# Altium project LIB_TEST.PrjPcb (part 1 of 4)
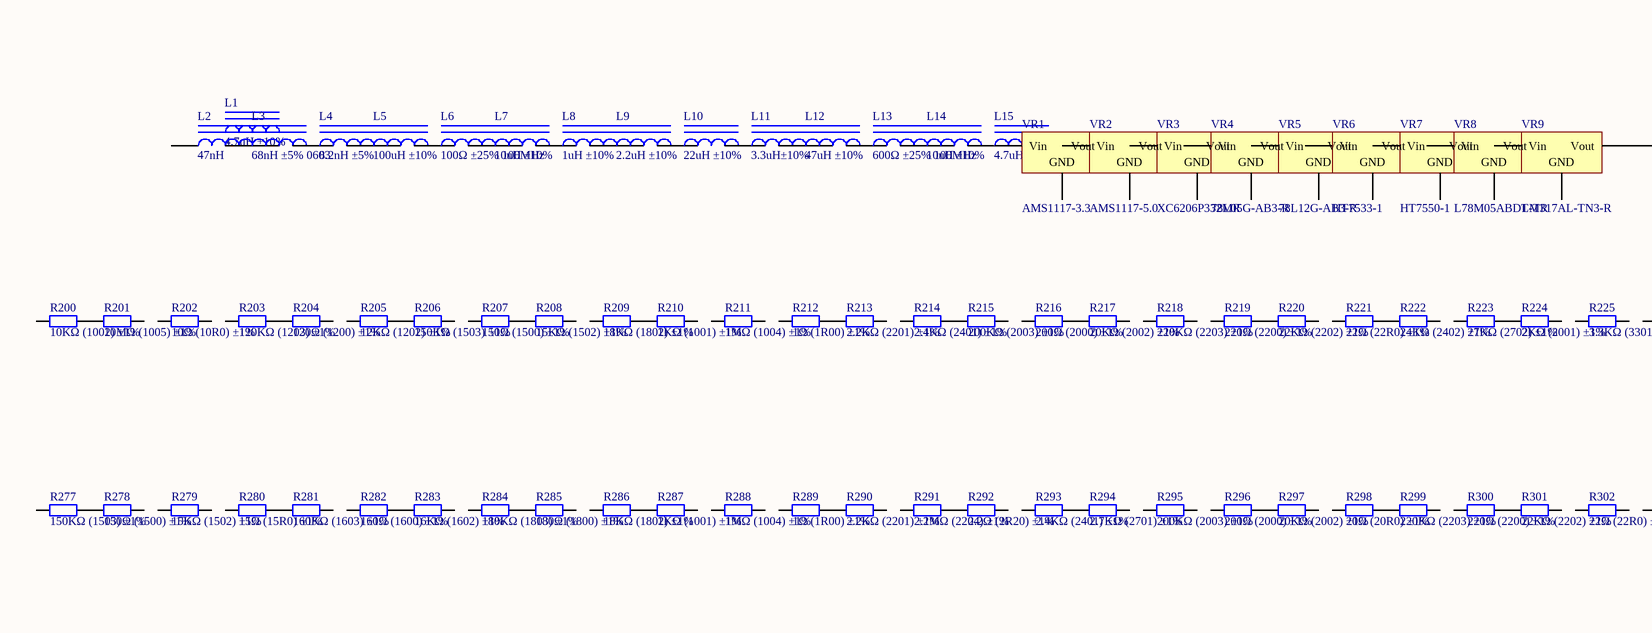
[diagram p0: 2.SchDoc, left]
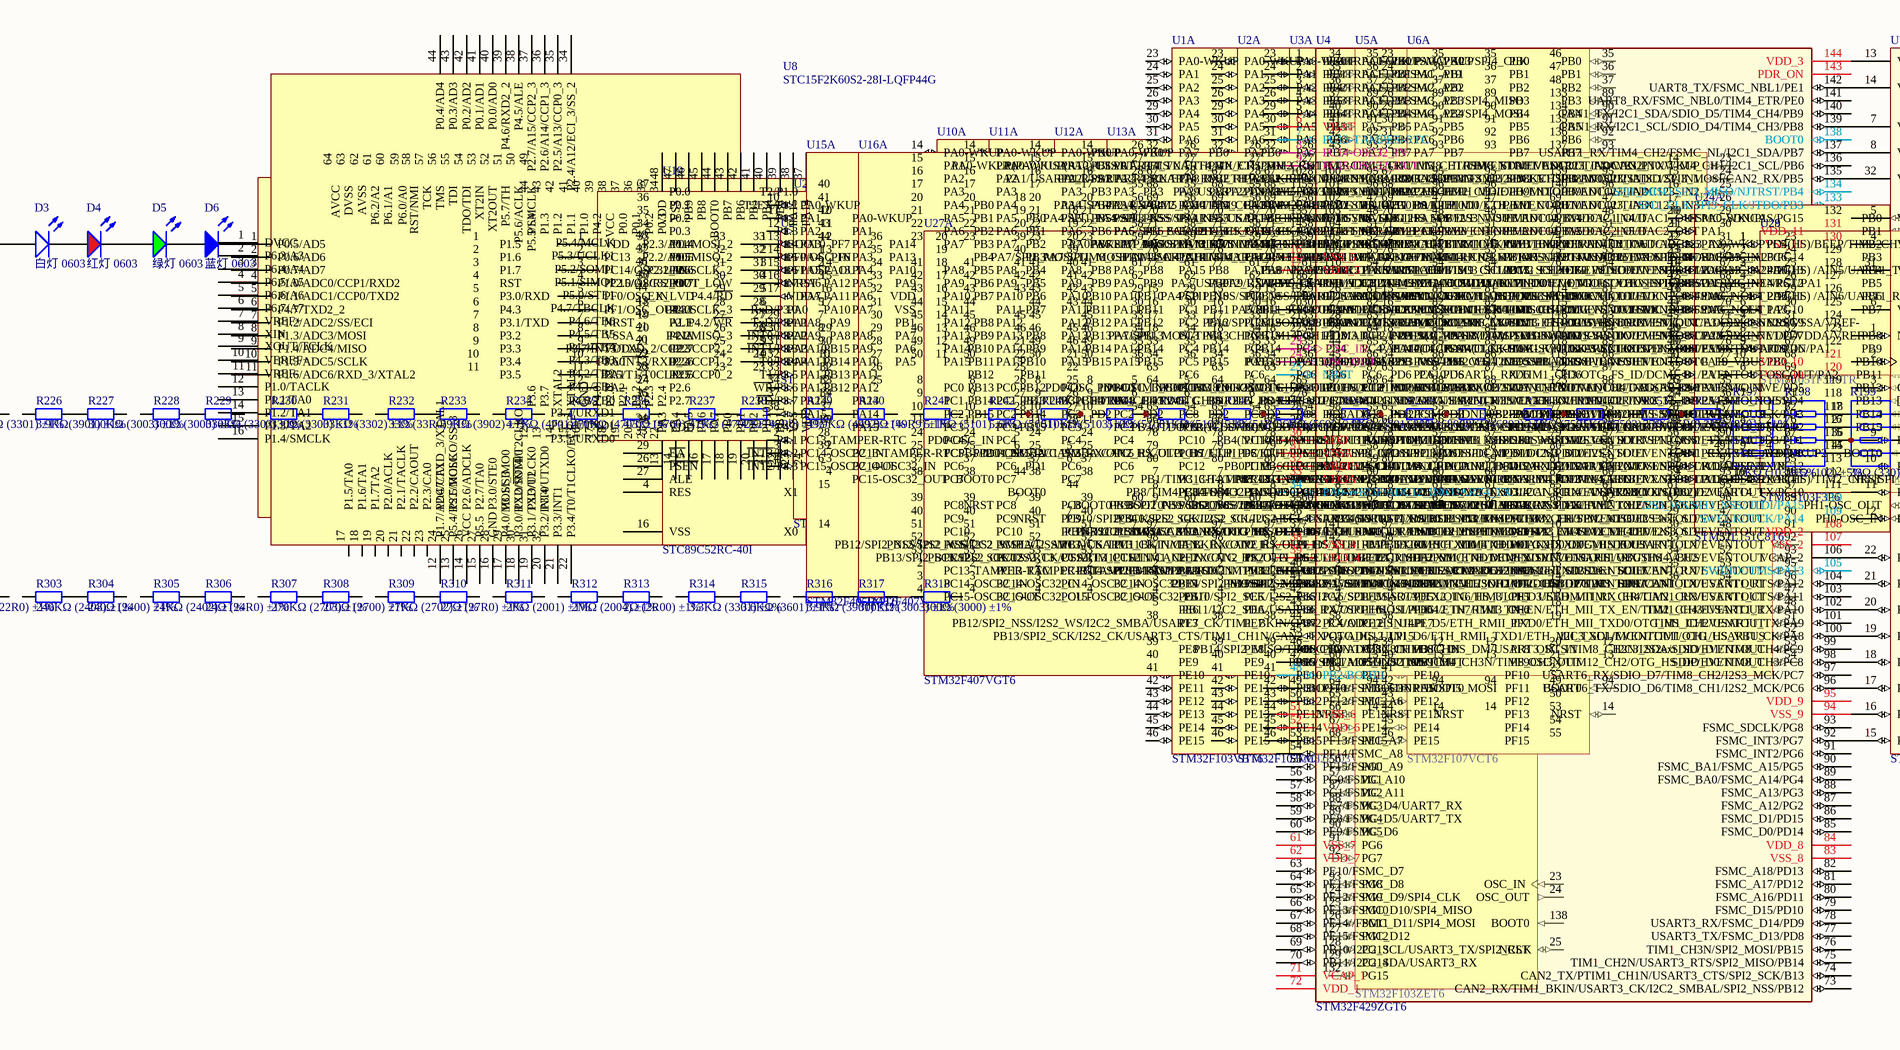
[diagram p1: 2.SchDoc, middle]
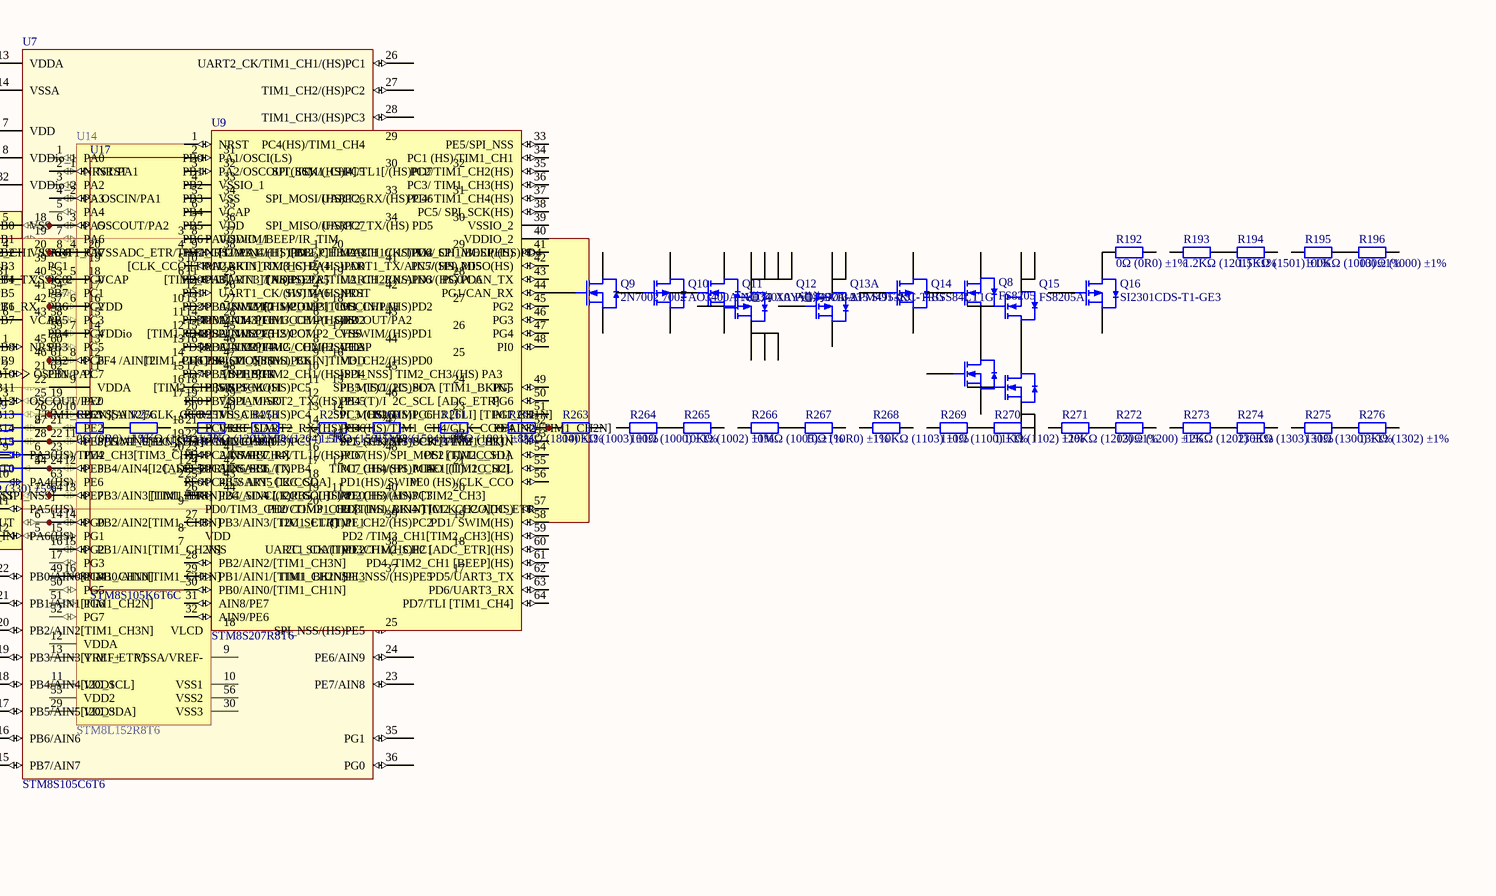
[diagram p2: 2.SchDoc, right]
2 sheets, 400 parts. Net scope: global (net labels, ports and power ports of the same name join across sheets).
Board file: PCB.PcbDoc
Sheets:
  2.SchDoc
  3.SchDoc

## Sheet 2.SchDoc
size A0

### Parts
D3  白灯 0603  [LC-0603_LED_S1]
D4  红灯 0603  [LC-0603_LED_S1]
D5  绿灯 0603  [LC-0603_LED_S1]
D6  蓝灯 0603  [LC-0603_LED_S1]
D7  黄灯 0603  [LC-0603_LED_S1]
D8  白灯 0805  [LC-0805_LED_S1]
D9  红灯 0805  [LC-0805_LED_S1]
D10  翠绿 0805  [LC-0805_LED_S1]
D11  蓝灯 0805  [LC-0805_LED_S1]
D12  黄灯 0805  [LC-0805_LED_S1]
L1  4.7uH ±10%  [LC-0603_L]
L2  47nH  [LC-0603_L]
L3  68nH ±5% 0603  [LC-0603_L]
L4  8.2nH ±5%  [LC-0603_L]
L5  100uH ±10%  [LC-0805_L]
L6  100Ω ±25% 100MHz  [LC-0805_L]
L7  10uH ±10%  [LC-0805_L]
L8  1uH ±10%  [LC-0805_L]
L9  2.2uH ±10%  [LC-0805_L]
L10  22uH ±10%  [LC-0805_L]
L11  3.3uH±10%  [LC-0805_L]
L12  47uH ±10%  [LC-0805_L]
L13  600Ω ±25% 100MHz  [LC-0805_L]
L14  10uH ±10%  [LC-1206_L]
L15  4.7uH  ±10%  [LC-1206_L]
Q8  FS8205  [LC-SOT-23-6]
Q9  2N7002 7002  [LC-SOT-23(SOT-23-3)]
Q10  AO3400A N道沟 X0YV1T SOT-23  [LC-SOT-23(SOT-23-3)]
Q11  AO3401A P道沟 X13A15 SOT-23  [LC-SOT-23(SOT-23-3)]
Q12  AO4407A  [LC-SOIC-8_150mil]
Q13  APM4953KC-TRG  [LC-SOP-8_150mil]  (part A of 2)
Q14  BSS84LT1G  [LC-SOT-23(SOT-23-3)]
Q15  FS8205A  [LC-TSSOP-8_3x4.4x065P]
Q16  SI2301CDS-T1-GE3  [LC-SOT-23(SOT-23-3)]
R192  0Ω (0R0) ±1%  [LC-0402_R]
R193  1.2KΩ (1201) ±1%  [LC-0402_R]
R194  1.5KΩ (1501) ±1%  [LC-0402_R]
R195  100KΩ (1003) ±1%  [LC-0402_R]
R196  100Ω (1000) ±1%  [LC-0402_R]
R197  10KΩ (103) ±5%  [LC-0402_Rx4]
R198  1KΩ (102) ±5%  [LC-0402_Rx4]
R199  33Ω (330) ±5%  [LC-0402_Rx4]
R200  10KΩ (1002) ±1%  [LC-0402_R]
R201  10MΩ (1005) ±1%  [LC-0402_R]
R202  10Ω (10R0) ±1%  [LC-0402_R]
R203  120KΩ (1203) ±1%  [LC-0402_R]
R204  120Ω (1200) ±1%  [LC-0402_R]
R205  12KΩ (1202) ±1%  [LC-0402_R]
R206  150KΩ (1503) ±1%  [LC-0402_R]
R207  150Ω (1500) ±1%  [LC-0402_R]
R208  15KΩ (1502) ±1%  [LC-0402_R]
R209  18KΩ (1802) ±1%  [LC-0402_R]
R210  1KΩ (1001) ±1%  [LC-0402_R]
R211  1MΩ (1004) ±1%  [LC-0402_R]
R212  1Ω (1R00) ±1%  [LC-0402_R]
R213  2.2KΩ (2201) ±1%  [LC-0402_R]
R214  2.4KΩ (2401) ±1%  [LC-0402_R]
R215  200KΩ (2003) ±1%  [LC-0402_R]
R216  200Ω (2000) ±1%  [LC-0402_R]
R217  20KΩ (2002) ±1%  [LC-0402_R]
R218  220KΩ (2203) ±1%  [LC-0402_R]
R219  220Ω (2200) ±1%  [LC-0402_R]
R220  22KΩ (2202) ±1%  [LC-0402_R]
R221  22Ω (22R0) ±1%  [LC-0402_R]
R222  24KΩ (2402) ±1%  [LC-0402_R]
R223  27KΩ (2702) ±1%  [LC-0402_R]
R224  2KΩ (2001) ±1%  [LC-0402_R]
R225  3.3KΩ (3301) ±1%  [LC-0402_R]
R226  3.9KΩ(3901) ±1%  [LC-0402_R]
R227  300KΩ (3003) ±1%  [LC-0402_R]
R228  300Ω (3000) ±1%  [LC-0402_R]
R229  330KΩ (3303) ±1%  [LC-0402_R]
R230  330Ω (3300) ±1%  [LC-0402_R]
R231  33KΩ (3302) ±1%  [LC-0402_R]
R232  33Ω (33R0) ±1%  [LC-0402_R]
R233  39KΩ (3902) ±1%  [LC-0402_R]
R234  4.7KΩ (4701) ±1%  [LC-0402_R]
R235  470KΩ (4703) ±1%  [LC-0402_R]
R236  470Ω (4700) ±1%  [LC-0402_R]
R237  47KΩ (4702) ±1%  [LC-0402_R]
R238  47Ω (47R0) ±1%  [LC-0402_R]
R239  49.9KΩ (4992) ±1%  [LC-0402_R]
R240  49.9Ω (49R9) ±1%  [LC-0402_R]
R241  5.1KΩ (5101) ±1%  [LC-0402_R]
R242  5.6KΩ (5601) ±1%  [LC-0402_R]
R243  510KΩ (5103) ±1%  [LC-0402_R]
R244  510Ω (5100) ±1%  [LC-0402_R]
R245  51KΩ (5102) ±1%  [LC-0402_R]
R246  51Ω (51R0) ±1%  [LC-0402_R]
R247  56KΩ (5602) ±1%  [LC-0402_R]
R248  6.8KΩ (6801) ±1%  [LC-0402_R]
R249  680Ω (6800) ±1%  [LC-0402_R]
R250  68KΩ (6802) ±1%  [LC-0402_R]
R251  7.5KΩ (7501) ±1%  [LC-0402_R]
R252  75KΩ (7502) ±1%  [LC-0402_R]
R253  75Ω (75R0) ±1%  [LC-0402_R]
R254  8.2KΩ (8201) ±1%  [LC-0402_R]
R255  0Ω (0R0) ±1%  [LC-0603_R]
R256  1.1KΩ (1101) ±1%  [LC-0603_R]
R257  1.2KΩ (1201) ±1%  [LC-0603_R]
R258  1.2MΩ (1204) ±1%  [LC-0603_R]
R259  1.5KΩ (1501) ±1%  [LC-0603_R]
R260  1.5MΩ (1504) ±1%  [LC-0603_R]
R261  1.8KΩ (1801) ±1%  [LC-0603_R]
R262  1.8MΩ (1804) ±1%  [LC-0603_R]
R263  100KΩ (1003) ±1%  [LC-0603_R]
R264  100Ω (1000) ±1%  [LC-0603_R]
R265  10KΩ (1002) ±1%  [LC-0603_R]
R266  10MΩ (1005) ±1%  [LC-0603_R]
R267  10Ω (10R0) ±1%  [LC-0603_R]
R268  110KΩ (1103) ±1%  [LC-0603_R]
R269  110Ω (1100) ±1%  [LC-0603_R]
R270  11KΩ (1102) ±1%  [LC-0603_R]
R271  120KΩ (1203) ±1%  [LC-0603_R]
R272  120Ω (1200) ±1%  [LC-0603_R]
R273  12KΩ (1202) ±1%  [LC-0603_R]
R274  130KΩ (1303) ±1%  [LC-0603_R]
R275  130Ω (1300) ±1%  [LC-0603_R]
R276  13KΩ (1302) ±1%  [LC-0603_R]
R277  150KΩ (1503) ±1%  [LC-0603_R]
R278  150Ω (1500) ±1%  [LC-0603_R]
R279  15KΩ (1502) ±1%  [LC-0603_R]
R280  15Ω (15R0) ±1%  [LC-0603_R]
R281  160KΩ (1603) ±1%  [LC-0603_R]
R282  160Ω (1600) ±1%  [LC-0603_R]
R283  16KΩ (1602) ±1%  [LC-0603_R]
R284  180KΩ (1803) ±1%  [LC-0603_R]
R285  180Ω (1800) ±1%  [LC-0603_R]
R286  18KΩ (1802) ±1%  [LC-0603_R]
R287  1KΩ (1001) ±1%  [LC-0603_R]
R288  1MΩ (1004) ±1%  [LC-0603_R]
R289  1Ω (1R00) ±1%  [LC-0603_R]
R290  2.2KΩ (2201) ±1%  [LC-0603_R]
R291  2.2MΩ (2204) ±1%  [LC-0603_R]
R292  2.2Ω (2R20) ±1%  [LC-0603_R]
R293  2.4KΩ (2401) ±1%  [LC-0603_R]
R294  2.7KΩ (2701) ±1%  [LC-0603_R]
R295  200KΩ (2003) ±1%  [LC-0603_R]
R296  200Ω (2000) ±1%  [LC-0603_R]
R297  20KΩ (2002) ±1%  [LC-0603_R]
R298  20Ω (20R0) ±1%  [LC-0603_R]
R299  220KΩ (2203) ±1%  [LC-0603_R]
R300  220Ω (2200) ±1%  [LC-0603_R]
R301  22KΩ (2202) ±1%  [LC-0603_R]
R302  22Ω (22R0) ±1%  [LC-0603_R]
R303  240KΩ (2403) ±1%  [LC-0603_R]
R304  240Ω (2400) ±1%  [LC-0603_R]
R305  24KΩ (2402) ±1%  [LC-0603_R]
R306  24Ω (24R0) ±1%  [LC-0603_R]
R307  270KΩ (2703) ±1%  [LC-0603_R]
R308  270Ω (2700) ±1%  [LC-0603_R]
R309  27KΩ (2702) ±1%  [LC-0603_R]
R310  27Ω (27R0) ±1%  [LC-0603_R]
R311  2KΩ (2001) ±1%  [LC-0603_R]
R312  2MΩ (2004) ±1%  [LC-0603_R]
R313  2Ω (2R00) ±1%  [LC-0603_R]
R314  3.3KΩ (3301) ±1%  [LC-0603_R]
R315  3.6KΩ (3601) ±1%  [LC-0603_R]
R316  3.9KΩ (3901) ±1%  [LC-0603_R]
R317  300KΩ (3003) ±1%  [LC-0603_R]
R318  300Ω (3000) ±1%  [LC-0603_R]
U1  STM32F103VBT6  [LC-LQFP-100_14x14x05P]  (part A of 2)
U2  STM32F103VCT6  [LC-LQFP-100_14x14x05P]  (part A of 2)
U3  STM32F103VET6  [LC-LQFP-100_14x14x05P]  (part A of 2)
U4  STM32F429ZGT6  [LC-LQFP-144_20x20x05P]
U5  STM32F103ZET6  [LC-LQFP-144_20x20x05P]  (part A of 2)
U6  STM32F107VCT6  [LC-LQFP-100_14x14x05P]  (part A of 2)
U7  STM8S105C6T6  [LC-LQFP-48_7x7x05P]
U8  STC15F2K60S2-28I-LQFP44G  [LC-LQFP-44_10x10x08P]
U9  STM8S207R8T6  [LC-LQFP-64_10x10x05P]
U10  STM32F103R8T6  [LC-LQFP-64_10x10x05P]  (part A of 2)
U11  STM32F103RBT6  [LC-LQFP-64_10x10x05P]  (part A of 2)
U12  STM32F103RCT6  [LC-LQFP-64_10x10x05P]  (part A of 2)
U13  STM32F103RET6  [LC-LQFP-64_10x10x05P]  (part A of 2)
U14  STM8L152R8T6  [LC-LQFP-64_10x10x05P]
U15  STM32F405RGT6  [LC-LQFP-64_10x10x05P]  (part A of 4)
U16  STM32F407VET6  [LC-LQFP-100_14x14x05P]  (part A of 5)
U17  STM8S105K6T6C  [LC-LQFP-32_7x7x08P]
U18  MSP430F149IPMRG4  [LC-LQFP-64_10x10x05P_Q2]
U19  STC89C52RC-40I  [LC-LQFP-44_10x10x08P]
U20  STM32F103C8T6  [LC-LQFP-48_7x7x05P]  (part A of 2)
U21  STM32F030C8T6  [LC-LQFP-48_7x7x05P]
U22  STC12C5A60S2-35I  [LC-LQFP-44_10x10x08P]
U23  STM32F103CBT6  [LC-LQFP-48_7x7x05P]  (part A of 2)
U24  STM32L151C8T6  [LC-LQFP-48_7x7x05P]  (part A of 2)
U25  STM8L101F3P6  [LC-TSSOP-20]
U26  STM32F030F4P6  [LC-TSSOP-20]
U27  STM32F407VGT6  [LC-LQFP-100_14x14x05P]  (part A of 5)
U28  STM8S103F3P6  [LC-TSSOP-20]
U29  STM8L051F3P6TR  [LC-TSSOP-20]
U30  STM8S003F3P6  [LC-TSSOP-20]
VR1  AMS1117-3.3  [LC-SOT-223]
VR2  AMS1117-5.0  [LC-SOT-223]
VR3  XC6206P332MR  [LC-SOT-23(SOT-23-3)]
VR4  78L05G-AB3-R  [LC-SOT-89(SOT-89-3)]
VR5  78L12G-AB3-R  [LC-SOT-89(SOT-89-3)]
VR6  HT7533-1  [LC-SOT-89(SOT-89-3)]
VR7  HT7550-1  [LC-SOT-89(SOT-89-3)]
VR8  L78M05ABDT-TR  [LC-TO-252-2-180]
VR9  LM317AL-TN3-R  [LC-TO-252-2-180]

### Nets
NetD3_A: D3.A VR9.2(Vout)
NetD4_K: D4.K D5.A
NetD6_K: D6.K D7.A
NetD8_K: D8.K D9.A
NetD10_K: D10.K D11.A
NetD11_K: D11.K D12.A
NetQ8_2: Q8.2(D) Q8.5(D)
NetQ9_1: Q9.1(G) U9.44(PG1/CAN_RX)
NetQ15_1: Q15.1(D) Q15.8(D)
NetQ16_3: Q16.3(D) R192.1
NetR193_2: R193.2 R194.1
NetR195_2: R195.2 R196.1
NetR197_6: R197.6 U27.77(PA15(JTDI)/JTDI/SPI3_NSS/I2S3_WS/TIM2_CH1_ETR/SPI1_NSS/EVENTOUT)
NetR197_7: R197.7 U27.76(PA14(JTCK-SWCLK)/JTCK-SWCLK/EVENTOUT)
NetR197_8: R197.8 U27.72(PA13(JTMS-SWDIO)/JTMS-SWDIO/EVENTOUT)
NetR198_5: R198.5 U4.114(CAN1_RX/FSMC_D2/PD0)
NetR198_6: R198.6 U4.115(CAN1_TX/FSMC_D3/PD1) U7.9(PA3(HS)/TIM2_CH3[TIM3_CH1])
NetR198_7: R198.7 U4.116(SDIO_CMD/UART5_RX//TIM3_ETR/PD2)
NetR198_8: R198.8 U4.117(SPI2_CLK/FSMC_CLK/PD3)
NetR199_5: R199.5 U14.24(PE5) U17.12(PB4/AIN4[I2C_SCL]) U24.44(BOOT0)
NetR199_6: R199.6 U14.23(PE4)
NetR199_7: R199.7 U14.22(PE3) U17.11(PB5/AIN5[I2C_SDA]) U24.28(PB15)
NetR199_8: R199.8 U14.21(PE2) U24.27(PB14)
NetR200_2: R200.2 R201.1
NetR203_2: R203.2 R204.1
NetR205_2: R205.2 R206.1
NetR207_2: R207.2 R208.1
NetR209_2: R209.2 R210.1
NetR212_2: R212.2 R213.1
NetR214_2: R214.2 R215.1
NetR216_2: R216.2 R217.1
NetR219_2: R219.2 R220.1
NetR221_2: R221.2 R222.1
NetR223_2: R223.2 R224.1
NetR226_2: R226.2 R227.1
NetR228_2: R228.2 R229.1
NetR230_2: R230.2 R231.1
NetR232_2: R232.2 R233.1
NetR235_2: R235.2 R236.1
NetR237_2: R237.2 R238.1
NetR239_2: R239.2 R240.1
NetR241_1: R241.1 U10.10(PC2)
NetR241_2: R241.2 U11.10(PC2)
NetR242_2: R242.2 R243.1 U12.10(PC2) U20.28(PB15)
NetR243_2: R243.2 U13.10(PC2) U23.27(PB14)
NetR244_2: R244.2 R245.1 U1.65(PC8) U10.54(PD2)
NetR245_2: R245.2 U11.54(PD2)
NetR246_1: R246.1 U2.65(PC8)
NetR246_2: R246.2 R247.1 U3.65(PC8) U12.54(PD2)
NetR247_2: R247.2 U13.54(PD2)
NetR248_1: R248.1 U5.98(PC8)
NetR248_2: R248.2 U1.55(PD8) U6.65(PC8)
NetR249_2: R249.2 R250.1 U2.55(PD8)
NetR250_2: R250.2 U3.55(PD8)
NetR251_2: R251.2 R252.1 U5.77(PD8)
NetR252_2: R252.2 U6.55(PD8)
NetR253_2: R253.2 R254.1 U15.28(PB2-BOOT1(PB2)/EVENTOUT)
NetR254_2: R254.2 U16.37(PB2-BOOT1(PB2)/EVENTOUT)
NetR255_2: R255.2 R256.1
NetR256_2: R256.2 U25.18(PC0/I2C_SDA)
NetR257_1: R257.1 U9.21(VREF)
NetR257_2: R257.2 R258.1
NetR258_2: R258.2 U30.14(PC4_(HS)/TIM1_CH4/CLK_CCO/AIN2/[TIM1_CH2N])
NetR259_2: R259.2 R260.1
NetR260_2: R260.2 U7.47(UART2_RX/(HS)_PD6)
NetR262_2: R262.2 R263.1 U9.52(PE4)
NetR264_2: R264.2 R265.1
NetR266_2: R266.2 R267.1
NetR269_2: R269.2 R270.1
NetR271_2: R271.2 R272.1
NetR273_2: R273.2 R274.1
NetR275_2: R275.2 R276.1
NetR277_2: R277.2 R278.1
NetR280_2: R280.2 R281.1
NetR282_2: R282.2 R283.1
NetR284_2: R284.2 R285.1
NetR286_2: R286.2 R287.1
NetR289_2: R289.2 R290.1
NetR291_2: R291.2 R292.1
NetR293_2: R293.2 R294.1
NetR296_2: R296.2 R297.1
NetR298_2: R298.2 R299.1
NetR300_2: R300.2 R301.1
NetR303_2: R303.2 R304.1
NetR305_2: R305.2 R306.1
NetR307_2: R307.2 R308.1
NetR309_2: R309.2 R310.1
NetR312_2: R312.2 R313.1
NetR314_2: R314.2 R315.1
NetR316_2: R316.2 R317.1
NetR318_1: R318.1 U10.4(PC15-OSC32_OUT)
NetR318_2: R318.2 U11.4(PC15-OSC32_OUT)
NetU1_9: U1.9(PC15-OSC32_OUT) U10.60(BOOT0)
NetU1_12: U1.12(OSC_IN) U6.39(PE8)
NetU1_13: U1.13(OSC_OUT) U6.40(PE9)
NetU1_14: U1.14(NRST) U6.44(PE13)
NetU1_15: U1.15(PC0) U10.29(PB10)
NetU1_16: U1.16(PC1) U10.30(PB11)
NetU1_17: U1.17(PC2) U10.33(PB12)
NetU1_18: U1.18(PC3) U10.34(PB13)
NetU1_32: U1.32(PA7) U10.26(PB0)
NetU1_33: U1.33(PC4) U10.35(PB14)
NetU1_34: U1.34(PC5) U10.36(PB15)
NetU1_35: U1.35(PB0) U6.23(PA0-WKUP)
NetU1_36: U1.36(PB1) U6.24(PA1)
NetU1_37: U1.37(PB2) U6.25(PA2)
NetU1_47: U1.47(PB10) U6.69(PA10)
NetU1_48: U1.48(PB11) U6.70(PA11)
NetU1_51: U1.51(PB12) U6.71(PA12)
NetU1_52: U1.52(PB13) U6.72(PA13)
NetU1_53: U1.53(PB14) U6.76(PA14)
NetU1_54: U1.54(PB15) U6.77(PA15)
NetU1_56: U1.56(PD9) U6.66(PC9)
NetU1_57: U1.57(PD10) U6.78(PC10)
NetU1_58: U1.58(PD11) U6.79(PC11)
NetU1_59: U1.59(PD12) U6.80(PC12)
NetU1_60: U1.60(PD13) U6.7(PC13-TAMPER-RTC)
NetU1_61: U1.61(PD14) U6.8(PC14-OSC32_IN)
NetU1_62: U1.62(PD15) U6.9(PC15-OSC32_OUT)
NetU1_64: U1.64(PC7) U10.5(PD0-OSC_IN)
NetU1_67: U1.67(PA8) U10.28(PB2)
NetU1_68: U1.68(PA9) U10.55(PB3)
NetU1_69: U1.69(PA10) U10.56(PB4)
NetU1_70: U1.70(PA11) U10.57(PB5)
NetU1_71: U1.71(PA12) U10.58(PB6)
NetU1_72: U1.72(PA13) U10.59(PB7)
NetU1_77: U1.77(PA15) U10.61(PB8)
NetU1_81: U1.81(PD0) U6.15(PC0)
NetU1_82: U1.82(PD1) U6.16(PC1)
NetU1_83: U1.83(PD2) U6.17(PC2)
NetU1_84: U1.84(PD3) U6.18(PC3)
NetU1_85: U1.85(PD4) U6.33(PC4)
NetU1_86: U1.86(PD5) U6.34(PC5)
NetU1_87: U1.87(PD6) U6.63(PC6)
NetU1_88: U1.88(PD7) U6.64(PC7)
NetU1_89: U1.89(PB3) U6.26(PA3)
NetU1_90: U1.90(PB4) U6.29(PA4)
NetU1_91: U1.91(PB5) U6.30(PA5)
NetU1_92: U1.92(PB6) U6.31(PA6)
NetU1_93: U1.93(PB7) U6.32(PA7)
NetU1_94: U1.94(BOOT0) U6.42(PE11)
NetU1_95: U1.95(PB8) U6.67(PA8)
NetU1_96: U1.96(PB9) U6.68(PA9)
NetU1_97: U1.97(PE0) U10.7(NRST)
NetU3_9: U3.9(PC15-OSC32_OUT) U12.60(BOOT0)
NetU3_15: U3.15(PC0) U12.29(PB10)
NetU3_16: U3.16(PC1) U12.30(PB11)
NetU3_17: U3.17(PC2) U12.33(PB12)
NetU3_18: U3.18(PC3) U12.34(PB13)
NetU3_32: U3.32(PA7) U12.26(PB0)
NetU3_33: U3.33(PC4) U12.35(PB14)
NetU3_34: U3.34(PC5) U12.36(PB15)
NetU3_64: U3.64(PC7) U12.5(PD0-OSC_IN)
NetU3_67: U3.67(PA8) U12.28(PB2)
NetU3_68: U3.68(PA9) U12.55(PB3)
NetU3_69: U3.69(PA10) U12.56(PB4)
NetU3_70: U3.70(PA11) U12.57(PB5)
NetU3_71: U3.71(PA12) U12.58(PB6)
NetU3_72: U3.72(PA13) U12.59(PB7)
NetU3_77: U3.77(PA15) U12.61(PB8)
NetU3_97: U3.97(PE0) U12.7(NRST)
NetU4_92: U4.92(FSMC_INT3/PG7) U7.15(PB7/AIN7)
NetU4_94: U4.94(VSS_9) U7.16(PB6/AIN6)
NetU4_96: U4.96(USART6_TX/SDIO_D6/TIM8_CH1/I2S2_MCK/PC6) U7.17(PB5/AIN5[I2C_SDA])
NetU4_98: U4.98(SDIO_D0/TIM8_CH3/PC8) U7.18(PB4/AIN4[I2C_SCL])
NetU4_100: U4.100(I2C3_SCL/MCO1/TIM1_CH1/USART1_CK/PA8) U7.19(PB3/AIN3[TIM1_ETR])
NetU4_102: U4.102(TIM1_CH3/USART1_RX/PA10) U7.20(PB2/AIN2[TIM1_CH3N])
NetU4_104: U4.104(USBDP/TIM1_ETR/CAN1_TX/USART1_RTS/PA12) U7.21(PB1/AIN1[TIM1_CH2N])
NetU4_106: U4.106(VCAP_2) U7.22(PB0/AIN0[TIM1_CH1N])
NetU4_109: U4.109(SWCLK/JTCK/PA14) U7.12(PA6(HS))
NetU4_111: U4.111(USART3_TX/SDIO_D2/UART4_TX/PC10) U7.11(PA5(HS))
NetU4_113: U4.113(SPI3_MOSI/SDIO_CK/UART5_TX/PC12) U7.10(PA4(HS))
NetU4_119: U4.119(USART2_TX/FSMC_NWE/PD5) U7.3(OSCOUT/PA2)
NetU4_121: U4.121(VDD_10) U7.2(OSCIN/PA1)
NetU4_123: U4.123(FSMC_NCE2/FSMC_NE1/PD7) U7.1(NRST)
NetU4_125: U4.125(FSMC_NE3/FSMC_NCE4_1/PG10) U7.6(VCAP)
NetU4_128: U4.128(SPI6_CLK/FSMC_A24/PG13) U7.31(VSSio_2)
NetU4_130: U4.130(VSS_11) U7.4(VSSio_1)
NetU4_132: U4.132(FSMC_SDNCAS/PG15) U7.5(VSS)
NetU4_135: U4.135(FSMC_SDCKE1/SPI1_MOSI/I2S3_SD/SPI3_MOSI/CAN2_RX/PB5) U7.32(VDDio_2)
NetU4_137: U4.137(USART1_RX/TIM4_CH2/FSMC_NL/I2C1_SDA/PB7) U7.8(VDDio_1)
NetU4_139: U4.139(CAN1_RX/I2C1_SCL/SDIO_D4/TIM4_CH3/PB8) U7.7(VDD)
NetU4_142: U4.142(UART8_TX/FSMC_NBL1/PE1) U7.14(VSSA)
NetU4_144: U4.144(VDD_3) U7.13(VDDA)
NetU11_23: U11.23(PA7) U26.20(PA14)
NetU11_41: U11.41(PA8) U26.18(PA10)
NetU11_42: U11.42(PA9) U26.17(PA9)
NetU11_43: U11.43(PA10) U26.16(VDD)
NetU11_44: U11.44(PA11) U26.15(VSS)
NetU11_45: U11.45(PA12) U26.14(PB1)
NetU11_46: U11.46(PA13) U26.13(PA7)
NetU11_49: U11.49(PA14) U26.12(PA6)
NetU11_50: U11.50(PA15) U26.11(PA5)
NetU12_8: U12.8(PC0) U20.26(PB13)
NetU12_9: U12.9(PC1) U20.27(PB14)
NetU12_20: U12.20(PA4) U20.18(PB0)
NetU12_21: U12.21(PA5) U20.19(PB1)
NetU12_22: U12.22(PA6) U20.20(PB2)
NetU12_23: U12.23(PA7) U20.39(PB3)
NetU12_24: U12.24(PC4) U20.5(PD0-OSC_IN)
NetU12_25: U12.25(PC5) U20.6(PD1)
NetU12_38: U12.38(PC7) U20.44(BOOT0)
NetU12_39: U12.39(PC8) U20.7(NRST)
NetU12_41: U12.41(PA8) U20.41(PB5)
NetU12_42: U12.42(PA9) U20.42(PB6)
NetU12_43: U12.43(PA10) U20.43(PB7)
NetU12_45: U12.45(PA12) U20.45(PB8)
NetU12_46: U12.46(PA13) U20.46(PB9)
NetU12_49: U12.49(PA14) U20.21(PB10)
NetU12_50: U12.50(PA15) U20.22(PB11)
NetU13_8: U13.8(PC0) U23.25(PB12)
NetU13_9: U13.9(PC1) U23.26(PB13)
NetU13_11: U13.11(PC3) U23.28(PB15)
NetU13_21: U13.21(PA5) U23.18(PB0)
NetU13_22: U13.22(PA6) U23.19(PB1)
NetU13_23: U13.23(PA7) U23.20(PB2)
NetU13_25: U13.25(PC5) U23.5(PD0-OSC_IN)
NetU13_37: U13.37(PC6) U23.6(PD1)
NetU13_40: U13.40(PC9) U23.7(NRST)
NetU13_41: U13.41(PA8) U23.40(PB4)
NetU13_42: U13.42(PA9) U23.41(PB5)
NetU13_43: U13.43(PA10) U23.42(PB6)
NetU13_44: U13.44(PA11) U23.43(PB7)
NetU13_46: U13.46(PA13) U23.45(PB8)
NetU13_49: U13.49(PA14) U23.46(PB9)
NetU13_50: U13.50(PA15) U23.21(PB10)
NetU14_2: U14.2(NRST/PA1) U17.1(NRST)
NetU14_4: U14.4(PA3) U17.2(OSCIN/PA1)
NetU14_6: U14.6(PA5) U17.3(OSCOUT/PA2) U24.18(PB0)
NetU14_7: U14.7(PA6) U24.19(PB1)
NetU14_8: U14.8(PA7) U17.4(VSS) U24.20(PB2)
NetU14_14: U14.14(PG0) U17.14(PB2/AIN2[TIM1_CH3N]) U24.6(PH1-OSC_OUT)
NetU14_15: U14.15(PG1) U24.5(PH0-OSC_IN)
NetU14_16: U14.16(PG2) U17.15(PB1/AIN1[TIM1_CH2N])
NetU14_19: U14.19(PE0) U24.25(PB12)
NetU14_20: U14.20(PE1) U17.10(VSSA) U24.26(PB13)
NetU14_49: U14.49(PG4) U17.16(PB0/AIN0[TIM1_CH1N])
NetU14_53: U14.53(PC0) U17.5(VCAP) U24.40(PB4)
NetU14_54: U14.54(PC1) U24.41(PB5)
NetU14_57: U14.57(PC2) U17.6(VDD) U24.42(PB6)
NetU14_58: U14.58(PC3) U24.43(PB7)
NetU14_59: U14.59(PC4) U17.7(VDDio)
NetU14_60: U14.60(PC5) U24.45(PB8)
NetU14_61: U14.61(PC6) U17.8(PF4_/AIN12) U24.46(PB9)
NetU14_62: U14.62(PC7) U24.21(PB10)
NetU14_64: U14.64(PE7) U17.13(PB3/AIN3[TIM1_ETR]) U24.7(NRST)
NetU17_9: U17.9(VDDA) U24.22(PB11)
NetU28_1: U28.1(PD4(HS)/BEEP/TIM2_CH1__/UART1_CK) U29.1(PC5)
NetU28_2: U28.2(PD5(HS)_/AIN5/UART1_TX) U29.3(PA0)
NetU28_3: U28.3(PD6(HS)_/AIN6/UART1_RX) U29.5(PA2)
NetU28_4: U28.4(NRST) U29.7(VSS/VSSA/VREF-)
NetU28_5: U28.5(OSCIN/PA1) U29.9(PD0)
NetVR1_2: VR1.2(Vout) VR3.3(Vin)

Not connected (* = marked no-connect by the designer): D3 K; D4 A; D5 K; D6 A; D7 K; D8 A; D9 K; D10 A; D12 K; L1 1 2; L2 1 2; L3 1 2; L4 1 2; L5 1 2; L6 1 2; L7 1 2; L8 1 2; L9 1 2; L10 1 2; L11 1 2; L12 1 2; L13 1 2; L14 1 2; L15 1 2; Q8 1(G) 3(S) 4(G); Q9 2(S) 3(D); Q10 1(G) 2(S) 3(D); Q11 1(G) 2(S) 3(D); Q12 1(S) 2(S) 3(S) 4(G) 5(D) 6(D) 7(D) 8(D); Q13 1(S) 2(G) 7(D) 8(D); Q14 1(G) 2(S) 3(D); Q15 2(S) 3(S) 4(G) 5(G) 6(S) 7(S); Q16 1(G) 2(S); R192 2; R193 1; R194 2; R195 1; R196 2; R197 1 2 3 4 5; R198 1 2 3 4; R199 1 2 3 4; R200 1; R201 2; R202 1 2; R203 1; R204 2; R205 1; R206 2; R207 1; R208 2; R209 1; R210 2; R211 1 2; R212 1; R213 2; R214 1; R215 2; R216 1; R217 2; R218 1 2; R219 1; R220 2; R221 1; R222 2; R223 1; R224 2; R225 1 2; R226 1; R227 2; R228 1; R229 2; R230 1; R231 2; R232 1; R233 2; R234 1 2; R235 1; R236 2; R237 1; R238 2; R239 1; R240 2; R242 1; R244 1; R249 1; R251 1; R253 1; R255 1; R259 1; R261 1 2; R262 1; R263 2; R264 1; R265 2; R266 1; R267 2; R268 1 2; R269 1; R270 2; R271 1; R272 2; R273 1; R274 2; R275 1; R276 2; R277 1; R278 2; R279 1 2; R280 1; R281 2; R282 1; R283 2; R284 1; R285 2; R286 1; R287 2; R288 1 2; R289 1; R290 2; R291 1; R292 2; R293 1; R294 2; R295 1 2; R296 1; R297 2; R298 1; R299 2; R300 1; R301 2; R302 1 2; R303 1; R304 2; R305 1; R306 2; R307 1; R308 2; R309 1; R310 2; R311 1 2; R312 1; R313 2; R314 1; R315 2; R316 1; R317 2; U1 1(PE2) 2(PE3) 3(PE4) 4(PE5) 5(PE6) 7(PC13-TAMPER-RTC) 8(PC14-OSC32_IN) 23(PA0-WKUP) 24(PA1) 25(PA2) 26(PA3) 29(PA4) 30(PA5) 31(PA6) 38(PE7) 39(PE8) 40(PE9) 41(PE10) 42(PE11) 43(PE12) 44(PE13) 45(PE14) 46(PE15) 63(PC6) 66(PC9) 76(PA14) 78(PC10) 79(PC11) 80(PC12) 98(PE1); U2 1(PE2) 2(PE3) 3(PE4) 4(PE5) 5(PE6) 7(PC13-TAMPER-RTC) 8(PC14-OSC32_IN) 9(PC15-OSC32_OUT) 12(OSC_IN) 13(OSC_OUT) 14(NRST) 15(PC0) 16(PC1) 17(PC2) 18(PC3) 23(PA0-WKUP) 24(PA1) 25(PA2) 26(PA3) 29(PA4) 30(PA5) 31(PA6) 32(PA7) 33(PC4) 34(PC5) 35(PB0) 36(PB1) 37(PB2) 38(PE7) 39(PE8) 40(PE9) 41(PE10) 42(PE11) 43(PE12) 44(PE13) 45(PE14) 46(PE15) 47(PB10) 48(PB11) 51(PB12) 52(PB13) 53(PB14) 54(PB15) 56(PD9) 57(PD10) 58(PD11) 59(PD12) 60(PD13) 61(PD14) 62(PD15) 63(PC6) 64(PC7) 66(PC9) 67(PA8) 68(PA9) 69(PA10) 70(PA11) 71(PA12) 72(PA13) 76(PA14) 77(PA15) 78(PC10) 79(PC11) 80(PC12) 81(PD0) 82(PD1) 83(PD2) 84(PD3) 85(PD4) 86(PD5) 87(PD6) 88(PD7) 89(PB3) 90(PB4) 91(PB5) 92(PB6) 93(PB7) 94(BOOT0) 95(PB8) 96(PB9) 97(PE0) 98(PE1); U3 1(PE2) 2(PE3) 3(PE4) 4(PE5) 5(PE6) 7(PC13-TAMPER-RTC) 8(PC14-OSC32_IN) 12(OSC_IN) 13(OSC_OUT) 14(NRST) 23(PA0-WKUP) 24(PA1) 25(PA2) 26(PA3) 29(PA4) 30(PA5) 31(PA6) 35(PB0) 36(PB1) 37(PB2) 38(PE7) 39(PE8) 40(PE9) 41(PE10) 42(PE11) 43(PE12) 44(PE13) 45(PE14) 46(PE15) 47(PB10) 48(PB11) 51(PB12) 52(PB13) 53(PB14) 54(PB15) 56(PD9) 57(PD10) 58(PD11) 59(PD12) 60(PD13) 61(PD14) 62(PD15) 63(PC6) 66(PC9) 76(PA14) 78(PC10) 79(PC11) 80(PC12) 81(PD0) 82(PD1) 83(PD2) 84(PD3) 85(PD4) 86(PD5) 87(PD6) 88(PD7) 89(PB3) 90(PB4) 91(PB5) 92(PB6) 93(PB7) 94(BOOT0) 95(PB8) 96(PB9) 98(PE1); U4 1(PE2/TRACECLK/FSMC_A23/SPI4_CLK) 2(PE3/TRACED0/FSMC_A19) 3(PE4/TRACED1/FSMC_A20) 4(PE5/TRACED2/FSMC_A21/SPI4_MISO) 5(PE6/TRACED3/FSMC_A22/SPI4_MOSI) 6(VBAT) 7(PC13-TAMPER-RTC) 8(PC14-OSC32_IN) 9(PC15-OSC32_OUT) 10(PF0/FSMC_A0/I2C2_SDA) 11(PF1/FSMC_A1/I2C2_SCL) 12(PF2/FSMC_A2) 13(PF3/FSMC_A3) 14(PF4/FSMC_A4) 15(PF5/FSMC_A5) 16(VSS_5) 17(VDD_5) 18(PF6/ADC3_IN4/FSMC_NIORD/UART7_RX) 19(PF7/ADC3_IN5/FSMC_NREG/UART7_TX/SPI5_SCK) 20(PF8/ADC3_IN6/FSMC_NIOWR/SPI5_MISO) 21(PF9/ADC3_IN7/FSMC_CD/SPI5_MOSI) 22(PF10/ADC3_IN8/FSMC_INTR) 23(OSC_IN) 24(OSC_OUT) 25(NRST) 26(PC0/ADC12_IN10/FSMC_SDNWE) 27(PC1/ADC12_IN11) 28(PC2/ADC12_IN12/FSMC_SDNE0/SPI2_MISO) 29(PC3/ADC12_IN13/FSMC_SDCKE0/SPI2_MOSI) 30(VDD) 31(VSSA) 32(VREF+) 33(VDDA) 34(PA0-WKUP/ADC12_IN0/UART4_TX) 35(PA1/USART2_RTS/ADC12_IN1/UART4_RX) 36(PA2/USART2_TX/ADC12_IN2/TIM2_CH3) 37(PA3/USART2_RX/ADC12_IN3/TIM2_CH4) 38(VSS_4) 39(VDD_4) 40(PA4/SPI1_NSS/USART2_CK/ADC12_IN4) 41(PA5/SPI1_SCK/ADC12_IN5) 42(PA6/SPI1_MISO/ADC12_IN6/TIM3_CH1) 43(PA7/SPI1_MOSI/ADC12_IN7/TIM3_CH2) 44(PC4/ADC12_IN14) 45(PC5/ADC12_IN15) 46(PB0/ADC_IN8/TIM3_CH3) 47(PB1/ADC_IN9/TIM3_CH4) 48(PB2/BOOT1) 49(PF11/FSMC_SDNRAS/SPI5_MOSI) 50(PF12/FSMC_A6) 51(VSS_6) 52(VDD_6) 53(PF13/FSMC_A7) 54(PF14/FSMC_A8) 55(PF15/FSMC_A9) 56(PG0/FSMC_A10) 57(PG1/FSMC_A11) 58(PE7/FSMC_D4/UART7_RX) 59(PE8/FSMC_D5/UART7_TX) 60(PE9/FSMC_D6) 61(VSS_7) 62(VDD_7) 63(PE10/FSMC_D7) 64(PE11/FSMC_D8) 65(PE12/FSMC_D9/SPI4_CLK) 66(PE13/FSMC_D10/SPI4_MISO) 67(PE14//FSMC_D11/SPI4_MOSI) 68(PE15/FSMC_D12) 69(PB10/I2C2_SCL/USART3_TX/SPI2_CLK) 70(PB11/I2C2_SDA/USART3_RX) 71(VCAP_1) 72(VDD_1) 73(CAN2_RX/TIM1_BKIN/USART3_CK/I2C2_SMBAL/SPI2_NSS/PB12) 74(CAN2_TX/PTIM1_CH1N/USART3_CTS/SPI2_SCK/B13) 75(TIM1_CH2N/USART3_RTS/SPI2_MISO/PB14) 76(TIM1_CH3N/SPI2_MOSI/PB15) 77(USART3_TX/FSMC_D13/PD8) 78(USART3_RX/FSMC_D14/PD9) 79(FSMC_D15/PD10) 80(FSMC_A16/PD11) 81(FSMC_A17/PD12) 82(FSMC_A18/PD13) 83(VSS_8) 84(VDD_8) 85(FSMC_D0/PD14) 86(FSMC_D1/PD15) 87(FSMC_A12/PG2) 88(FSMC_A13/PG3) 89(FSMC_BA0/FSMC_A14/PG4) 90(FSMC_BA1/FSMC_A15/PG5) 91(FSMC_INT2/PG6) 93(FSMC_SDCLK/PG8) 95(VDD_9) 97(USART6_RX/SDIO_D7/TIM8_CH2/I2S3_MCK/PC7) 99(I2C3_SDA/SDIO_D1/TIM8_CH4/PC9) 101(TIM1_CH2/USART1_TX/PA9) 103(USBDM/TIM1_CH4/CAN1_RX/USART1_CTS/PA11) 105(SWDIO/JTMS/PA13) 107(VSS_2) 108(VDD_2) 110(I2S3_WS/SPI3_NSS//JTDI/PA15) 112(USART3_RX/SDIO_D3/UART4_RX/PC11) 118(FSMC_NOE/PD4) 120(VSS_10) 122(USART2_RX/SPI3_MOSI/FSMC_NWAIT/PD6) 124(USART6_RX/FSMC_NCE3/FSMC_NE2/PG9) 126(FSMC_NCE4_2/PG11) 127(SPI6_MISO/FSMC_NE4/PG12) 129(USART6_TX/SPI6_MOSI/FSMC_A25/PG14) 131(VDD_11) 133(SPI1_CLK/SPI3_CLK/JTDO/PB3) 134(SPI1_MISO/SPI3_MISO/NJTRST/PB4) 136(FSMC_SDNE1/USART1_TX/CAN2_TX/TIM4_CH1/I2C1_SCL/PB6) 138(BOOT0) 140(CAN1_TX/I2C1_SDA/SDIO_D5/TIM4_CH4/PB9) 141(UART8_RX/FSMC_NBL0/TIM4_ETR/PE0) 143(PDR_ON); U5 1(PE2) 2(PE3) 3(PE4) 4(PE5) 5(PE6) 7(PC13-TAMPER-RTC) 8(PC14-OSC32_IN) 9(PC15-OSC32_OUT) 10(PF0) 11(PF1) 12(PF2) 13(PF3) 14(PF4) 15(PF5) 18(PF6) 19(PF7) 20(PF8) 21(PF9) 22(PF10) 23(OSC_IN) 24(OSC_OUT) 25(NRST) 26(PC0) 27(PC1) 28(PC2) 29(PC3) 34(PA0-WKUP) 35(PA1) 36(PA2) 37(PA3) 40(PA4) 41(PA5) 42(PA6) 43(PA7) 44(PC4) 45(PC5) 46(PB0) 47(PB1) 48(PB2) 49(PF11) 50(PF12) 53(PF13) 54(PF14) 55(PF15) 56(PG0) 57(PG1) 58(PE7) 59(PE8) 60(PE9) 63(PE10) 64(PE11) 65(PE12) 66(PE13) 67(PE14) 68(PE15) 69(PB10) 70(PB11) 73(PB12) 74(PB13) 75(PB14) 76(PB15) 78(PD9) 79(PD10) 80(PD11) 81(PD12) 82(PD13) 85(PD14) 86(PD15) 87(PG2) 88(PG3) 89(PG4) 90(PG5) 91(PG6) 92(PG7) 93(PG8) 96(PC6) 97(PC7) 99(PC9) 100(PA8) 101(PA9) 102(PA10) 103(PA11) 104(PA12) 105(PA13) 109(PA14) 110(PA15) 111(PC10) 112(PC11) 113(PC12) 114(PD0) 115(PD1) 116(PD2) 117(PD3) 118(PD4) 119(PD5) 122(PD6) 123(PD7) 124(PG9) 125(PG10) 126(PG11) 127(PG12) 128(PG13) 129(PG14) 132(PG15) 133(PB3) 134(PB4) 135(PB5) 136(PB6) 137(PB7) 138(BOOT0) 139(PB8) 140(PB9) 141(PE0) 142(PE1); U6 1(PE2) 2(PE3) 3(PE4) 4(PE5) 5(PE6) 12(OSC_IN) 13(OSC_OUT) 14(NRST) 35(PB0) 36(PB1) 37(PB2) 38(PE7) 41(PE10) 43(PE12) 45(PE14) 46(PE15) 47(PB10) 48(PB11) 51(PB12) 52(PB13) 53(PB14) 54(PB15) 56(PD9) 57(PD10) 58(PD11) 59(PD12) 60(PD13) 61(PD14) 62(PD15) 81(PD0) 82(PD1) 83(PD2) 84(PD3) 85(PD4) 86(PD5) 87(PD6) 88(PD7) 89(PB3) 90(PB4) 91(PB5) 92(PB6) 93(PB7) 94(BOOT0) 95(PB8) 96(PB9) 97(PE0) 98(PE1); U7 23(PE7/AIN8) 24(PE6/AIN9) 25(SPI_NSS/(HS)PE5) 26(UART2_CK/TIM1_CH1/(HS)PC1) 27(TIM1_CH2/(HS)PC2) 28(TIM1_CH3/(HS)PC3) 29(PC4(HS)/TIM1_CH4) 30(SPI_SCK/(HS)PC5) 33(SPI_MOSI/(HS)PC6) 34(SPI_MISO/(HS)PC7) 35(PG1) 36(PG0) 37(TIM1_BKIN/PE3) 38(I2C_SDA(T)PE2) 39(I2C_SCL/(T)PE1) 40(CLK_CCO(HS)/PE0) 41([CLK_CCO][TIM1_BKIN]TIM3_CH2/(HS)PD0) 42(SWIM/(HS)PD1) 43([TIM2_CH3]TIM3_CH1/(HS)PD2) 44([ADC_ETR]TIM2_CH2/(HS)PD3) 45([BEEP]TIM2_CH1/(HS)PD4) 46(UART2_TX/(HS)_PD5) 48(TIM1_CH4]/TL1[/(HS)PD7); U8 1(P0.5/AD5) 2(P0.6/AD6) 3(P0.7/AD7) 4(P1.0/ADC0/CCP1/RXD2) 5(P1.1/ADC1/CCP0/TXD2) 6(P4.7/TXD2_2) 7(P1.2/ADC2/SS/ECI) 8(P1.3/ADC3/MOSI) 9(P1.4/ADC4/MISO) 10(P1.5/ADC5/SCLK) 11(P1.6/ADC6/RXD_3/XTAL2) 12(P1.7/ADC7/TXD_3/XTAL1) 13(P5.4/RST/MCLKO/SS_3) 14(VCC) 15(P5.5) 16(GND) 17(P4.0/MOSI_3) 18(P3.0/RXD/~{INT4}/T2CLKO) 19(P3.1/TXD/T2) 20(P3.2/INT0) 21(P3.3/INT1) 22(P3.4/T0/T1CLKO/ECI_2) 23(P3.5/T1/T0CLKO/CCP0_2) 24(P3.6/~{INT2}/RXD_2/CCP1_2) 25(P3.7/~{INT3}/TXD_2/CCP2/CCP2_2) 26(P4.1/MISO_3) 27(P4.2/~{WR}) 28(P4.3/SCLK_3) 29(P4.4/~{RD}) 30(P2.0/A8/RSTOUT_LOW) 31(P2.1/A9/SCLK_2) 32(P2.2/A10/MISO_2) 33(P2.3/A11/MOSI_2) 34(P2.4/A12/ECI_3/SS_2) 35(P2.5/A13/CCP0_3) 36(P2.6/A14/CCP1_3) 37(P2.7/A15/CCP2_3) 38(P4.5/ALE) 39(P4.6/RXD2_2) 40(P0.0/AD0) 41(P0.1/AD1) 42(P0.2/AD2) 43(P0.3/AD3) 44(P0.4/AD4); U9 1(NRST) 2(PA1/OSCI(LS)) 3(PA2/OSCOUT(LS)) 4(VSSIO_1) 5(VSS) 6(VCAP) 7(VDD) 8(VDDIO_1) 9([TIM3_CH1]_TIM2_CH3/PA3) 10(UART1_RX/(HS)_PA4) 11(UART1_TX/(HS)_PA5) 12(UART1_CK/(HS)_PA6) 13(AIN15/PF7) 14(AIN14/PF6) 15(AIN13/PF5) 16(AIN12/PF4) 17(AIN11/PF3) 18(VREF+) 19(VDDA) 20(VSSA) 22(AIN10/
PF0) 23(AIN7/PB7) 24(AIN6/PB6) 25(PB5/_AIN5_[I2C_SDA]) 26(PB4/AIN4_[_I2C_SCL]) 27(PB3/AIN3/[TIM1_ETR]) 28(PB2/AIN2/[TIM1_CH3N]) 29(PB1/AIN1/[TIM1_CH2N]) 30(PB0/AIN0/[TIM1_CH1N]) 31(AIN8/PE7) 32(AIN9/PE6) 33(PE5/SPI_NSS) 34(PC1_(HS)/TIM1_CH1) 35(PC2/TIM1_CH2(HS)) 36(PC3/_TIM1_CH3(HS)) 37(PC4/_TIM1_CH4(HS)) 38(PC5/_SPI_SCK(HS)) 39(VSSIO_2) 40(VDDIO_2) 41(PC6/_SPI_MOSI(HS)) 42(PC7/_SPI_MISO(HS)) 43(PG0/CAN_TX) 45(PG2) 46(PG3) 47(PG4) 48(PI0) 49(PG5) 50(PG6) 51(PG7) 53(PE3/TIM1_BKIN) 54(PE2_(T)/I2C_SDA) 55(PE1_(T)/I2C_SCL) 56(PE0_(HS)/CLK_CCO) 57(PD0_/TIM3_CH2_[TIM1_BKIN]_[CLK_CCO](HS)) 58(PD1/_SWIM(HS)) 59(PD2_/TIM3_CH1[TIM2_CH3](HS)) 60(PD3_/TIM2_CH2_[ADC_ETR](HS)) 61(PD4_/TIM2_CH1_[BEEP](HS)) 62(PD5/UART3_TX) 63(PD6/UART3_RX) 64(PD7/TLI_[TIM1_CH4]); U10 2(PC13-TAMPER-RTC) 3(PC14-OSC32_IN) 6(PD1) 8(PC0) 9(PC1) 11(PC3) 14(PA0-WKUP) 15(PA1) 16(PA2) 17(PA3) 20(PA4) 21(PA5) 22(PA6) 23(PA7) 24(PC4) 25(PC5) 27(PB1) 37(PC6) 38(PC7) 39(PC8) 40(PC9) 41(PA8) 42(PA9) 43(PA10) 44(PA11) 45(PA12) 46(PA13) 49(PA14) 50(PA15) 51(PC10) 52(PC11) 53(PC12) 62(PB9); U11 2(PC13-TAMPER-RTC) 3(PC14-OSC32_IN) 5(PD0-OSC_IN) 6(PD1) 7(NRST) 8(PC0) 9(PC1) 11(PC3) 14(PA0-WKUP) 15(PA1) 16(PA2) 17(PA3) 20(PA4) 21(PA5) 22(PA6) 24(PC4) 25(PC5) 26(PB0) 27(PB1) 28(PB2) 29(PB10) 30(PB11) 33(PB12) 34(PB13) 35(PB14) 36(PB15) 37(PC6) 38(PC7) 39(PC8) 40(PC9) 51(PC10) 52(PC11) 53(PC12) 55(PB3) 56(PB4) 57(PB5) 58(PB6) 59(PB7) 60(BOOT0) 61(PB8) 62(PB9); U12 2(PC13-TAMPER-RTC) 3(PC14-OSC32_IN) 4(PC15-OSC32_OUT) 6(PD1) 11(PC3) 14(PA0-WKUP) 15(PA1) 16(PA2) 17(PA3) 27(PB1) 37(PC6) 40(PC9) 44(PA11) 51(PC10) 52(PC11) 53(PC12) 62(PB9); U13 2(PC13-TAMPER-RTC) 3(PC14-OSC32_IN) 4(PC15-OSC32_OUT) 5(PD0-OSC_IN) 6(PD1) 7(NRST) 14(PA0-WKUP) 15(PA1) 16(PA2) 17(PA3) 20(PA4) 24(PC4) 26(PB0) 27(PB1) 28(PB2) 29(PB10) 30(PB11) 33(PB12) 34(PB13) 35(PB14) 36(PB15) 38(PC7) 39(PC8) 45(PA12) 51(PC10) 52(PC11) 53(PC12) 55(PB3) 56(PB4) 57(PB5) 58(PB6) 59(PB7) 60(BOOT0) 61(PB8) 62(PB9); U14 1(PA0) 3(PA2) 5(PA4) 9(VSSA/VREF-) 10(VSS1) 11(VDD1) 12(VDDA) 13(VREF+) 17(PG3) 18(VLCD) 25(PD0) 26(PD1) 27(PD2) 28(PD3) 29(VDD3) 30(VSS3) 31(PB0) 32(PB1) 33(PB2) 34(PB3) 35(PB4) 36(PB5) 37(PB6) 38(PB7) 39(PF0) 40(PF1) 41(PF4) 42(PF5) 43(PF6) 44(PF7) 45(PD4) 46(PD5) 47(PD6) 48(PD7) 50(PG5) 51(PG6) 52(PG7) 55(VDD2) 56(VSS2) 63(PE6); U15 14(PA0-WKUP(PA0)/USART2_CTS/UART4_TX/ETH_MII_CRS/TIM2_CH1_ETR/TIM5_CH1/TIM8_ETR/EVENTOUT/ADC123_IN0/WKUP) 15(PA1/USART2_RTS/UART4_RX/ETH_RMII_REF_CLK/ETH_MII_RX_CLK/TIM5_CH2/TIM2_CH2/EVENTOUT/ADC123_IN1) 16(PA2/USART2_TX/TIM5_CH3/TIM9_CH1/TIM2_CH3/ETH_MDIO/EVENTOUT/ADC123_IN2) 17(PA3/USART2_RX/TIM5_CH4/TIM9_CH2/TIM2_CH4/OTG_HS_ULPI_D0/ETH_MII_COL/EVENTOUT/ADC123_IN3) 20(PA4/SPI1_NSS/SPI3_NSS/USART2_CK/DCMI_HSYNC/OTG_HS_SOF/I2S3_WS/EVENTOUT/ADC12_IN4/DAC1_OUT) 21(PA5/SPI1_SCK/OTG_HS_ULPI_CK/TIM2_CH1_ETR/TIM8_CHIN/EVENTOUT/ADC12_IN5/DAC2_OUT) 22(PA6/SPI1_MISO/TIM8_BKIN/TIM13_CH1/DCMI_PIXCLK/TIM3_CH1/TIM1_BKIN/EVENTOUT/ADC12_IN6) 23(PA7/SPI1_MOSI/TIM8_CH1N/TIM14_CH1/TIM3_CH2/ETH_MII_RX_DV/TIM1_CH1N/RMII_CRS_DV/EVENTOUT/ADC12_IN7) 26(PB0/TIM3_CH3/TIM8_CH2N/OTG_HS_ULPI_D1/ETH_MII_RXD2/TIM1_CH2N/EVENTOUT/ADC12_IN8) 27(PB1/TIM3_CH4/TIM8_CH3N/OTG_HS_ULPI_D2/ETH_MII_RXD3/OTG_HS_INTN/TIM1_CH3N/EVENTOUT/ADC12_IN9) 29(PB10/SPI2_SCK/I2S2_CK/I2C2_SCL/USART3_TX/OTG_HS_ULPI_D3/ETH_MII_RX_ER/TIM2_CH3/EVENTOUT) 30(PB11/I2C2_SDA/USART3_RX/OTG_HS_ULPI_D4/ETH_RMII_TX_EN/ETH_MII_TX_EN/TIM2_CH4/EVENTOUT) 33(PB12/SPI2_NSS/I2S2_WS/I2C2_SMBA/USART3_CK/TIM1_BKIN/CAN2_RX/OTG_HS_ULPI_D5/ETH_RMII_TXD0/ETH_MII_TXD0/OTG_HS_ID/EVENTOUT) 34(PB13/SPI2_SCK/I2S2_CK/USART3_CTS/TIM1_CH1N/CAN2_TX/OTG_HS_ULPI_D6/ETH_RMII_TXD1/ETH_MII_TXD1/EVENTOUT/OTG_HS_VBUS) 35(PB14/SPI2_MISO/TIM1_CH2N/TIM12_CH1/OTG_HS_DM/USART3_RTS/TIM8_CH2N/I2S2ext_SD/EVENTOUT) 36(PB15/SPI2_MOSI/I2S2_SD/TIM1_CH3N/TIM8_CH3N/TIM12_CH2/OTG_HS_DP/EVENTOUT) 41(PA8/MCO1/USART1_CK/TIM1_CH1/I2C3_SCL/OTG_FS_SOF/EVENTOUT) 42(PA9/USART1_TX/TIM1_CH2/I2C3_SMBA/DCMI_D0/EVENTOUT/OTG_FS_VBUS) 43(PA10/USART1_RX/TIM1_CH3/OTG_FS_ID/DCMI_D1/EVENTOUT) 44(PA11/USART1_CTS/CAN1_RX/TIM1_CH4/OTG_FS_DM/EVENTOUT) 45(PA12/USART1_RTS/CAN1_TX/TIM1_ETR/OTG_FS_DP/EVENTOUT) 46(PA13(JTMS-SWDIO)/JTMS-SWDIO/EVENTOUT) 49(PA14(JTCK-SWCLK)/JTCK-SWCLK/EVENTOUT) 50(PA15(JTDI)/JTDI/SPI3_NSS/I2S3_WS/TIM2_CH1_ETR/SPI1_NSS/EVENTOUT) 55(PB3(JTDO/TRACESWO)/JTDO/TRACESWO/SPI3_SCK/I2S3_CK/TIM2_CH2/SPI1_SCK/EVENTOUT) 56(PB4(NJTRST)/NJTRST/SPI3_MISO/TIM3_CH1/SPI1_MISO/I2S3ext_SD/EVENTOUT) 57(PB5/I2C1_SMBA/CAN2_RX/OTG_HS_ULPI_D7/ETH_PPS_OUT/TIM3_CH2/SPI1_MOSI/SPI3_MOSI/DCMI_D10/I2S3_SD/EVENTOUT) 58(PB6/I2C1_SCL/TIM4_CH1/CAN2_TX/DCMI_D5/USART1_TX/EVENTOUT) 59(PB7/I2C1_SDA/FSMC_NL/DCMI_VSYNC/USART1_RX/TIM4_CH2/EVENTOUT) 61(PB8/TIM4_CH3/SDIO_D4/TIM10_CH1/DCMI_D6/ETH_MII_TXD3/I2C1_SCL/CAN1_RX/EVENTOUT) 62(PB9/SPI2_NSS/I2S2_WS/TIM4_CH4/TIM11_CH1/SDIO_D5/DCMI_D7/I2C1_SDA/CAN1_TX/EVENTOUT); U16 23(PA0-WKUP(PA0)/USART2_CTS/UART4_TX/ETH_MII_CRS/TIM2_CH1_ETR/TIM5_CH1/TIM8_ETR/EVENTOUT/ADC123_IN0/WKUP) 24(PA1/USART2_RTS/UART4_RX/ETH_RMII_REF_CLK/ETH_MII_RX_CLK/TIM5_CH2/TIM2_CH2/EVENTOUT/ADC123_IN1) 25(PA2/USART2_TX/TIM5_CH3/TIM9_CH1/TIM2_CH3/ETH_MDIO/EVENTOUT/ADC123_IN2) 26(PA3/USART2_RX/TIM5_CH4/TIM9_CH2/TIM2_CH4/OTG_HS_ULPI_D0/ETH_MII_COL/EVENTOUT/ADC123_IN3) 29(PA4/SPI1_NSS/SPI3_NSS/USART2_CK/DCMI_HSYNC/OTG_HS_SOF/I2S3_WS/EVENTOUT/ADC12_IN4/DAC1_OUT) 30(PA5/SPI1_SCK/OTG_HS_ULPI_CK/TIM2_CH1_ETR/TIM8_CHIN/EVENTOUT/ADC12_IN5/DAC2_OUT) 31(PA6/SPI1_MISO/TIM8_BKIN/TIM13_CH1/DCMI_PIXCLK/TIM3_CH1/TIM1_BKIN/EVENTOUT/ADC12_IN6) 32(PA7/SPI1_MOSI/TIM8_CH1N/TIM14_CH1/TIM3_CH2/ETH_MII_RX_DV/TIM1_CH1N/RMII_CRS_DV/EVENTOUT/ADC12_IN7) 35(PB0/TIM3_CH3/TIM8_CH2N/OTG_HS_ULPI_D1/ETH_MII_RXD2/TIM1_CH2N/EVENTOUT/ADC12_IN8) 36(PB1/TIM3_CH4/TIM8_CH3N/OTG_HS_ULPI_D2/ETH_MII_RXD3/OTG_HS_INTN/TIM1_CH3N/EVENTOUT/ADC12_IN9) 47(PB10/SPI2_SCK/I2S2_CK/I2C2_SCL/USART3_TX/OTG_HS_ULPI_D3/ETH_MII_RX_ER/TIM2_CH3/EVENTOUT) 48(PB11/I2C2_SDA/USART3_RX/OTG_HS_ULPI_D4/ETH_RMII_TX_EN/ETH_MII_TX_EN/TIM2_CH4/EVENTOUT) 51(PB12/SPI2_NSS/I2S2_WS/I2C2_SMBA/USART3_CK/TIM1_BKIN/CAN2_RX/OTG_HS_ULPI_D5/ETH_RMII_TXD0/ETH_MII_TXD0/OTG_HS_ID/EVENTOUT) 52(PB13/SPI2_SCK/I2S2_CK/USART3_CTS/TIM1_CH1N/CAN2_TX/OTG_HS_ULPI_D6/ETH_RMII_TXD1/ETH_MII_TXD1/EVENTOUT/OTG_HS_VBUS) 53(PB14/SPI2_MISO/TIM1_CH2N/TIM12_CH1/OTG_HS_DM/USART3_RTS/TIM8_CH2N/I2S2ext_SD/EVENTOUT) 54(PB15/SPI2_MOSI/I2S2_SD/TIM1_CH3N/TIM8_CH3N/TIM12_CH2/OTG_HS_DP/EVENTOUT) 67(PA8/MCO1/USART1_CK/TIM1_CH1/I2C3_SCL/OTG_FS_SOF/EVENTOUT) 68(PA9/USART1_TX/TIM1_CH2/I2C3_SMBA/DCMI_D0/EVENTOUT/OTG_FS_VBUS) 69(PA10/USART1_RX/TIM1_CH3/OTG_FS_ID/DCMI_D1/EVENTOUT) 70(PA11/USART1_CTS/CAN1_RX/TIM1_CH4/OTG_FS_DM/EVENTOUT) 71(PA12/USART1_RTS/CAN1_TX/TIM1_ETR/OTG_FS_DP/EVENTOUT) 72(PA13(JTMS-SWDIO)/JTMS-SWDIO/EVENTOUT) 76(PA14(JTCK-SWCLK)/JTCK-SWCLK/EVENTOUT) 77(PA15(JTDI)/JTDI/SPI3_NSS/I2S3_WS/TIM2_CH1_ETR/SPI1_NSS/EVENTOUT) 89(PB3(JTDO/TRACESWO)/JTDO/TRACESWO/SPI3_SCK/I2S3_CK/TIM2_CH2/SPI1_SCK/EVENTOUT) 90(PB4(NJTRST)/NJTRST/SPI3_MISO/TIM3_CH1/SPI1_MISO/I2S3ext_SD/EVENTOUT) 91(PB5/I2C1_SMBA/CAN2_RX/OTG_HS_ULPI_D7/ETH_PPS_OUT/TIM3_CH2/SPI1_MOSI/SPI3_MOSI/DCMI_D10/I2S3_SD/EVENTOUT) 92(PB6/I2C1_SCL/TIM4_CH1/CAN2_TX/DCMI_D5/USART1_TX/EVENTOUT) 93(PB7/I2C1_SDA/FSMC_NL/DCMI_VSYNC/USART1_RX/TIM4_CH2/EVENTOUT) 95(PB8/TIM4_CH3/SDIO_D4/TIM10_CH1/DCMI_D6/ETH_MII_TXD3/I2C1_SCL/CAN1_RX/EVENTOUT) 96(PB9/SPI2_NSS/I2S2_WS/TIM4_CH4/TIM11_CH1/SDIO_D5/DCMI_D7/I2C1_SDA/CAN1_TX/EVENTOUT); U17 17(SPI_NSS/(HS)PE5) 18(UART1_CK/TIM1_CH1/(HS)PC1) 19(TIM1_CH2/(HS)PC2) 20(TIM1_CH3/(HS)PC3) 21(TIM1_CH4/(HS)PC4) 22(SPI_SCK/(HS)PC5) 23(SPI_MOSI/(HS)PC6) 24(SPI_MISO/(HS)PC7) 25([CLK_CCO][TIM1_BKIN]TIM3_CH2/(HS)PD0) 26(SWIM/(HS)PD1) 27([TIM2_CH3]TIM3_CH1/(HS)PD2) 28([ADC_ETR]TIM2_CH2/(HS)PD3) 29([BEEP]TIM2_CH1/(HS)PD4) 30(UART2_TX/(HS)_PD5) 31(UART2_RX/(HS)_PD6) 32(TIM1_CH4]/TL1[/(HS)PD7); U18 1(DVCC) 2(P6.3/A3) 3(P6.4/A4) 4(P6.5/A5) 5(P6.6/A6) 6(P6.7/A7) 7(VREF+) 8(XIN) 9(XOUT/TCLK) 10(VEREF+) 11(VREF-) 12(P1.0/TACLK) 13(P1.1/TA0) 14(P1.2/TA1) 15(P1.3/TA2) 16(P1.4/SMCLK) 17(P1.5/TA0) 18(P1.6/TA1) 19(P1.7TA2) 20(P2.0/ACLK) 21(P2.1/TACLK) 22(P2.2/CAOUT) 23(P2.3/CA0) 24(P2.4/CA1) 25(P2.5/ROSC) 26(P2.6/ADCLK) 27(P2.7/TA0) 28(P3.0/STE0) 29(P3.1/SIMO0) 30(P3.2/SOMI0) 31(P3.3/ULCK0) 32(P3.4/UTXD0) 33(P3.5/URXD0) 34(P3.6/UTXD1) 35(P3.7/URXD1) 36(P4.0/TB0) 37(P4.1/TB1) 38(P4.2/TB2) 39(P4.3/TB3) 40(P4.4/TB4) 41(P4.5/TB5) 42(P4.6/TB6) 43(P4.7/TBCLK) 44(P5.0/STE1) 45(P5.1/SIMO1) 46(P5.2/SOMI1) 47(P5.3/UCLK1) 48(P5.4/MCLK) 49(P5.5/SMCLK) 50(P5.6/ACLK) 51(P5.7/TH) 52(XT2OUT) 53(XT2IN) 54(TDO/TDI) 55(TDI) 56(TMS) 57(TCK) 58(RST/NMI) 59(P6.0/A0) 60(P6.1/A1) 61(P6.2/A2) 62(AVSS) 63(DVSS) 64(AVCC); U19 1(P1.5) 2(P1.6) 3(P1.7) 4(RES) 5(RxD/P3.0) 6(~{INT2}/P4.3) 7(TxD/P3.1) 8(~{INT0}/P3.2) 9(~{INT1}/P3.3) 10(T0/P3.4) 11(T1/P3.5) 12(~{WR}/P3.6) 13(~{RD}/P3.7) 14(X0) 15(X1) 16(VSS) 17(P4.0) 18(P2.0) 19(P2.1) 20(P2.2) 21(P2.3) 22(P2.4) 23(P2.5) 24(P2.6) 25(P2.7) 26(~{PSEN}) 27(ALE) 28(P4.1) 29(~{EA}) 30(P0.7) 31(P0.6) 32(P0.5) 33(P0.4) 34(P0.3) 35(P0.2) 36(P0.1) 37(P0.0) 38(VDD) 39(~{INT3}/P4.2) 40(T2/P1.0) 41(T2EX/P1.1) 42(P1.2) 43(P1.3) 44(P1.4); U20 2(PC13-TAMPER-RTC) 3(PC14-OSC32_IN) 4(PC15-OSC32_OUT) 10(PA0-WKUP) 11(PA1) 12(PA2) 13(PA3) 14(PA4) 15(PA5) 16(PA6) 17(PA7) 25(PB12) 29(PA8) 30(PA9) 31(PA10) 32(PA11) 33(PA12) 34(PA13) 37(PA14) 38(PA15) 40(PB4); U21 1(VDD) 2(PC13) 3(PC14/OSC32_IN) 4(PC15/OSC32_OUT) 5(PF0/OSC_IN) 6(PF1/OSC_OUT) 7(NRST) 8(VSSA) 9(VDDA) 10(PA0) 11(PA1) 12(PA2) 13(PA3) 14(PA4) 15(PA5) 16(PA6) 17(PA7) 18(PB0) 19(PB1) 20(PB2) 21(PB10) 22(PB11) 23(VSS) 24(VDD) 25(PB12) 26(PB13) 27(PB14) 28(PB15) 29(PA8) 30(PA9) 31(PA10) 32(PA11) 33(PA12) 34(PA13) 35(PF6) 36(PF7) 37(PA14) 38(PA15) 39(PB3) 40(PB4) 41(PB5) 42(PB6) 43(PB7) 44(BOOT0) 45(PB8) 46(PB9) 47(VSS) 48(VDD); U22 1(P1.5) 2(P1.6) 3(P1.7) 4(RST) 5(P3.0/RXD) 6(P4.3) 7(P3.1/TXD) 8(P3.2) 9(P3.3) 10(P3.4) 11(P3.5) 12(P3.6) 13(P3.7) 14(XTAL2) 15(XTAL1) 16(GND) 17(P4.0) 18(P2.0) 19(P2.1) 20(P2.2) 21(P2.3) 22(P2.4) 23(P2.5) 24(P2.6) 25(P2.7) 26(NA) 27(ALE) 28(P4.1) 29(EX_LVD) 30(P0.7) 31(P0.6) 32(P0.5) 33(P0.4) 34(P0.3) 35(P0.2) 36(P0.1) 37(P0.0) 38(VCC) 39(P4.2) 40(P1.0) 41(P1.1) 42(P1.2) 43(P1.3) 44(P1.4); U23 2(PC13-TAMPER-RTC) 3(PC14-OSC32_IN) 4(PC15-OSC32_OUT) 10(PA0-WKUP) 11(PA1) 12(PA2) 13(PA3) 14(PA4) 15(PA5) 16(PA6) 17(PA7) 22(PB11) 29(PA8) 30(PA9) 31(PA10) 32(PA11) 33(PA12) 34(PA13) 37(PA14) 38(PA15) 39(PB3) 44(BOOT0); U24 2(PC13-RTC_AF1-WKUP2) 3(PC14-OSC32_IN) 4(PC15-OSC32_OUT) 10(PA0-WKUP1) 11(PA1) 12(PA2) 13(PA3) 14(PA4) 15(PA5) 16(PA6) 17(PA7) 29(PA8) 30(PA9) 31(PA10) 32(PA11) 33(PA12) 34(PA13) 37(PA14) 38(PA15) 39(PB3); U25 1(PC3/USART_TX) 2(PC4/USART_CK/CCO) 3(PA0/SWIM/BEEP/IR_TIM) 4(NRST/PA1) 5(PA2) 6(PA3) 7(VSS) 8(VDD) 9(PD0/TIM3_CH2/COMP1_CH3) 10(PB0/TIM2_CH1/COMP1_CH1) 11(PB1/TIM3_CH1/COMP1_CH2) 12(PB2/TIM2_CH2/COMP2_CH1) 13(PB3/TIM2_TRIG/COMP2_CH2) 14(PB4/SPI_NSS) 15(PB5/SPI_SCK) 16(PB6/SPI_MOSI) 17(PB7/SPI_MISO) 19(PC1/I2C_SCL) 20(PC2/USART_RX); U26 1(BOOT0) 2(PF0/OSC_IN) 3(PF1/OSC_OUT) 4(NRST) 5(VDDA) 6(PA0) 7(PA1) 8(PA2) 9(PA3) 10(PA4) 19(PA13); U27 23(PA0-WKUP(PA0)/USART2_CTS/UART4_TX/ETH_MII_CRS/TIM2_CH1_ETR/TIM5_CH1/TIM8_ETR/EVENTOUT/ADC123_IN0/WKUP) 24(PA1/USART2_RTS/UART4_RX/ETH_RMII_REF_CLK/ETH_MII_RX_CLK/TIM5_CH2/TIM2_CH2/EVENTOUT/ADC123_IN1) 25(PA2/USART2_TX/TIM5_CH3/TIM9_CH1/TIM2_CH3/ETH_MDIO/EVENTOUT/ADC123_IN2) 26(PA3/USART2_RX/TIM5_CH4/TIM9_CH2/TIM2_CH4/OTG_HS_ULPI_D0/ETH_MII_COL/EVENTOUT/ADC123_IN3) 29(PA4/SPI1_NSS/SPI3_NSS/USART2_CK/DCMI_HSYNC/OTG_HS_SOF/I2S3_WS/EVENTOUT/ADC12_IN4/DAC1_OUT) 30(PA5/SPI1_SCK/OTG_HS_ULPI_CK/TIM2_CH1_ETR/TIM8_CHIN/EVENTOUT/ADC12_IN5/DAC2_OUT) 31(PA6/SPI1_MISO/TIM8_BKIN/TIM13_CH1/DCMI_PIXCLK/TIM3_CH1/TIM1_BKIN/EVENTOUT/ADC12_IN6) 32(PA7/SPI1_MOSI/TIM8_CH1N/TIM14_CH1/TIM3_CH2/ETH_MII_RX_DV/TIM1_CH1N/RMII_CRS_DV/EVENTOUT/ADC12_IN7) 35(PB0/TIM3_CH3/TIM8_CH2N/OTG_HS_ULPI_D1/ETH_MII_RXD2/TIM1_CH2N/EVENTOUT/ADC12_IN8) 36(PB1/TIM3_CH4/TIM8_CH3N/OTG_HS_ULPI_D2/ETH_MII_RXD3/OTG_HS_INTN/TIM1_CH3N/EVENTOUT/ADC12_IN9) 37(PB2-BOOT1(PB2)/EVENTOUT) 47(PB10/SPI2_SCK/I2S2_CK/I2C2_SCL/USART3_TX/OTG_HS_ULPI_D3/ETH_MII_RX_ER/TIM2_CH3/EVENTOUT) 48(PB11/I2C2_SDA/USART3_RX/OTG_HS_ULPI_D4/ETH_RMII_TX_EN/ETH_MII_TX_EN/TIM2_CH4/EVENTOUT) 51(PB12/SPI2_NSS/I2S2_WS/I2C2_SMBA/USART3_CK/TIM1_BKIN/CAN2_RX/OTG_HS_ULPI_D5/ETH_RMII_TXD0/ETH_MII_TXD0/OTG_HS_ID/EVENTOUT) 52(PB13/SPI2_SCK/I2S2_CK/USART3_CTS/TIM1_CH1N/CAN2_TX/OTG_HS_ULPI_D6/ETH_RMII_TXD1/ETH_MII_TXD1/EVENTOUT/OTG_HS_VBUS) 53(PB14/SPI2_MISO/TIM1_CH2N/TIM12_CH1/OTG_HS_DM/USART3_RTS/TIM8_CH2N/I2S2ext_SD/EVENTOUT) 54(PB15/SPI2_MOSI/I2S2_SD/TIM1_CH3N/TIM8_CH3N/TIM12_CH2/OTG_HS_DP/EVENTOUT) 67(PA8/MCO1/USART1_CK/TIM1_CH1/I2C3_SCL/OTG_FS_SOF/EVENTOUT) 68(PA9/USART1_TX/TIM1_CH2/I2C3_SMBA/DCMI_D0/EVENTOUT/OTG_FS_VBUS) 69(PA10/USART1_RX/TIM1_CH3/OTG_FS_ID/DCMI_D1/EVENTOUT) 70(PA11/USART1_CTS/CAN1_RX/TIM1_CH4/OTG_FS_DM/EVENTOUT) 71(PA12/USART1_RTS/CAN1_TX/TIM1_ETR/OTG_FS_DP/EVENTOUT) 89(PB3(JTDO/TRACESWO)/JTDO/TRACESWO/SPI3_SCK/I2S3_CK/TIM2_CH2/SPI1_SCK/EVENTOUT) 90(PB4(NJTRST)/NJTRST/SPI3_MISO/TIM3_CH1/SPI1_MISO/I2S3ext_SD/EVENTOUT) 91(PB5/I2C1_SMBA/CAN2_RX/OTG_HS_ULPI_D7/ETH_PPS_OUT/TIM3_CH2/SPI1_MOSI/SPI3_MOSI/DCMI_D10/I2S3_SD/EVENTOUT) 92(PB6/I2C1_SCL/TIM4_CH1/CAN2_TX/DCMI_D5/USART1_TX/EVENTOUT) 93(PB7/I2C1_SDA/FSMC_NL/DCMI_VSYNC/USART1_RX/TIM4_CH2/EVENTOUT) 95(PB8/TIM4_CH3/SDIO_D4/TIM10_CH1/DCMI_D6/ETH_MII_TXD3/I2C1_SCL/CAN1_RX/EVENTOUT) 96(PB9/SPI2_NSS/I2S2_WS/TIM4_CH4/TIM11_CH1/SDIO_D5/DCMI_D7/I2C1_SDA/CAN1_TX/EVENTOUT); U28 6(OSCOUT/PA2) 7(VSS) 8(VCAP) 9(VDD) 10(PA3(HS)/TIM2_CH3/[SPI_NSS]) 11([TIM1_BKIN]I2C_SDA_/(T)PB5) 12([ADC_ETR]I2C_SCL/(T)PB4) 13([TIM1_CH1N][TLI]/TIM1_CH3/(HS)PC3) 14([TIM1_CH2N][AIN2]/CLK_CCO/TIM1_CH4/(HS)PC4) 15([TIM2_CH1]SPI_SCK/(HS)PC5) 16([TIM1_CH1]/SPI_MOSI/(HS)PC6) 17([TIM1_CH2]SPI_MISO/(HS)PC7) 18(SWIM/(HS)PD1) 19([TIM2_CH3][AIN3]/(HS)PD2) 20(ADC_ETR/TIM2_CH2/AIN4/(HS)PD3); U29 2(PC6) 4(NRST/PA1) 6(PA3) 8(VDD/VDDA/VREF+) 10(PB0) 11(PB1) 12(PB2) 13(PB3) 14(PB4) 15(PB5) 16(PB6) 17(PB7) 18(PC0) 19(PC1) 20(PC4); U30 1(UART1_CK/TIM2_CH1/BEEP/(HS)PD4) 2(UART1_TX/AIN5/(HS)_PD5) 3(UART1_RX/AIN6/(HS)_PD6) 4(NRST) 5(OSCIN/PA1) 6(OSCOUT/PA2) 7(VSS) 8(VCAP) 9(VDD) 10([SPI_NSS]_TIM2_CH3/(HS)_PA3) 11(PB5_(T)/I__2C_SDA_[TIM1_BKIN]) 12(PB4_(T)/I__2C_SCL_[ADC_ETR]) 13(PC3_(HS)/TIM1_CH3_[TLI]_[TIM1_CH1N]) 15(PC5_(HS)/SPI_SCK_[TIM2_CH1]) 16(PC6_(HS)/SPI_MOSI_[TIM1_CH1]) 17(PC7_(HS)/SPI_MISO_[TIM1_CH2]) 18(PD1(HS)/SWIM) 19(PD2_(HS)/AIN3/[TIM2_CH3]) 20(PD3_(HS)/AIN4/TIM2_CH2/ADC_ETR); VR1 1(GND) 3(Vin); VR2 1(GND) 2(Vout) 3(Vin); VR3 1(GND) 2(Vout); VR4 1(Vin) 2(GND) 3(Vout); VR5 1(Vin) 2(GND) 3(Vout); VR6 1(GND) 2(Vin) 3(Vout); VR7 1(GND) 2(Vin) 3(Vout); VR8 1(Vin) 2(GND) 3(Vout); VR9 1(GND) 3(Vin)